# Altium schematic sheet Battery_PMIC_MCU_Prog_Schematic.SchDoc
size A; SheetNumber: 1; SheetTotal: 5
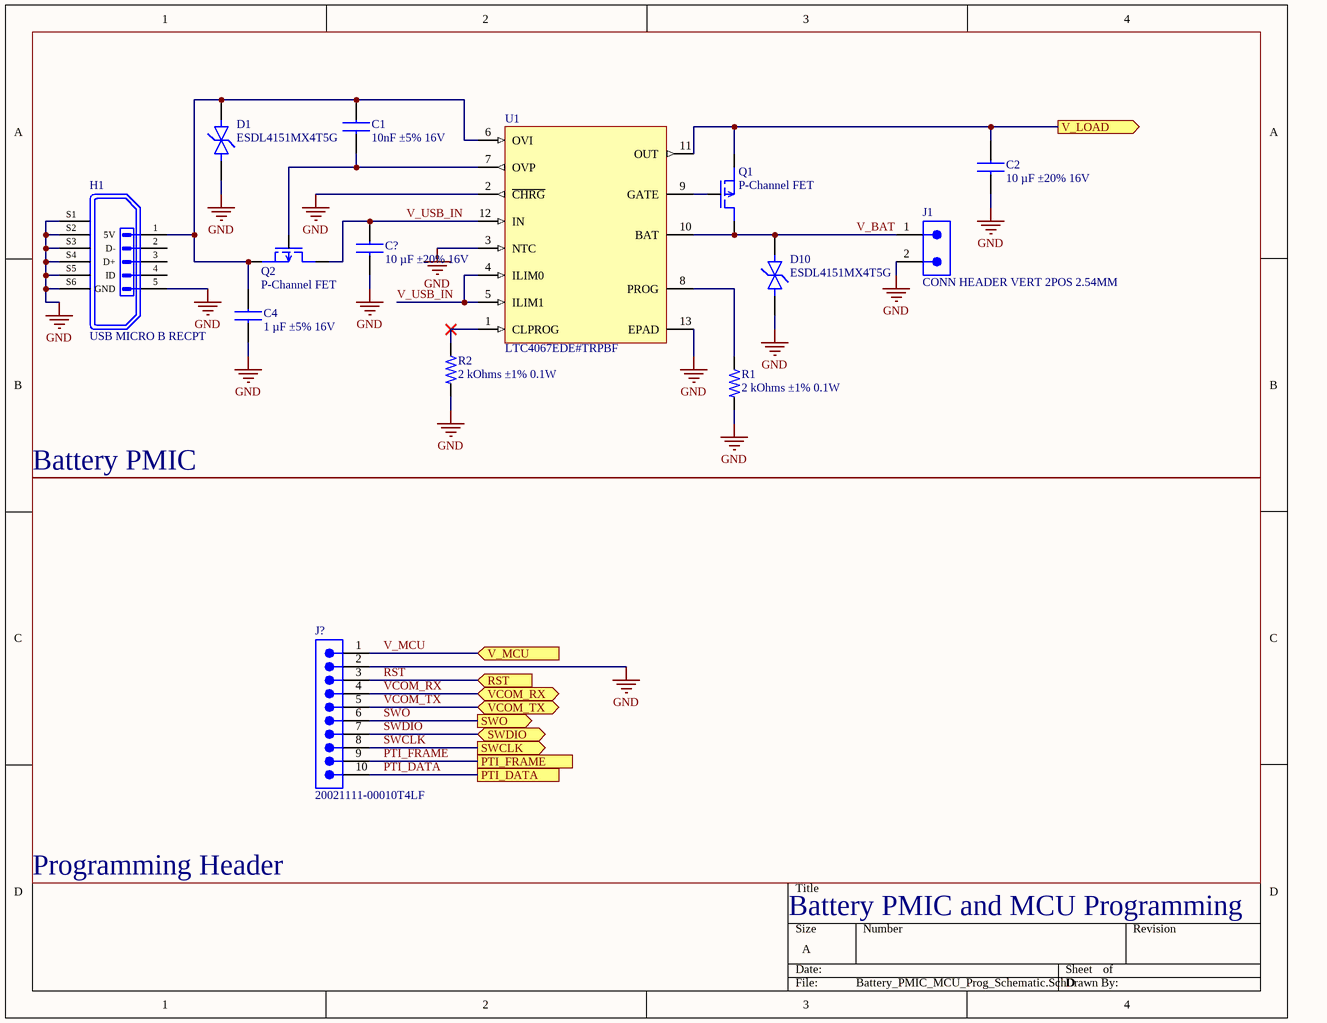
[diagram p0: Battery_PMIC_MCU_Prog_Schematic.SchDoc]

## Parts
C1  10nF ±5% 16V  [CAPC0603X09N]
C2  10 µF ±20% 16V  [CAPC0603X10N-M]
C4  1 µF ±5% 16V  [CAPC0603X10N]
C?  10 µF ±20% 16V  [CAPC0603X10N-M]
D1  ESDL4151MX4T5G  [DFN65P100X26-2N]
D10  ESDL4151MX4T5G  [DFN65P100X26-2N]
H1  USB MICRO B RECPT  [MICROUSB_AMPHENOL_10118194-0001LF]
J1  CONN HEADER VERT 2POS 2.54MM  [SAMTEC_TSW-102-14-L-S]
J?  20021111-00010T4LF  [CONN_MINITEK_2X5_HDR]
Q1  P-Channel FET  [SOT95P300X115-3N]
Q2  P-Channel FET  [SOT95P300X115-3N]
R1  2 kOhms ±1% 0.1W  [RESC0603X05N-1]
R2  2 kOhms ±1% 0.1W  [RESC0603X05N-1]
U1  LTC4067EDE#TRPBF  [SON50P300X80_HS-13N]

## Blocks framed on the sheet
Battery PMIC: C1 C2 C4 C? D1 D10 H1 J1 Q1 Q2 R1 R2 U1

## Ports
PTI_DATA, PTI_FRAME, RST (in), SWCLK (out), SWDIO (bidir), SWO (out), V_LOAD (out), V_MCU (in), VCOM_RX (bidir), VCOM_TX (bidir)

## Nets
GND: C2.2 C4.2 C?.2 D1.1 D10.1 H1.5(GND) H1.S1 H1.S2 H1.S3 H1.S4 H1.S5 H1.S6 J1.2 J?.2 R1.2 R2.2 U1.2(~{CHRG}) U1.3(NTC) U1.13(EPAD)
PTI_DATA: J?.10 ; port PTI_DATA
PTI_FRAME: J?.9 ; port PTI_FRAME
RST: J?.3 ; port RST
SWCLK: J?.8 ; port SWCLK
SWDIO: J?.7 ; port SWDIO
SWO: J?.6 ; port SWO
V_BAT: D10.2 J1.1 Q1.3 U1.10(BAT)
V_LOAD: C2.1 Q1.2 U1.11(OUT) ; port V_LOAD
V_MCU: J?.1 ; port V_MCU
V_USB_IN: C?.1 Q2.3 U1.4(ILIM0) U1.5(ILIM1) U1.12(IN)
VCOM_RX: J?.4 ; port VCOM_RX
VCOM_TX: J?.5 ; port VCOM_TX
NetC1_1: C1.1 C4.1 D1.2 H1.1(5V) Q2.2 U1.6(OVI)
NetC1_2: C1.2 Q2.1 U1.7(OVP)
NetQ1_1: Q1.1 U1.9(GATE)
NetR1_1: R1.1 U1.8(PROG)
NetR2_1: R2.1 U1.1(CLPROG)

Not connected (* = marked no-connect by the designer): H1 2(D-) 3(D+) 4(ID)

## Notes on the sheet
- Programming Header
- Battery PMIC and MCU Programming

## Library data of the parts
C1 = C0603C103J4RACTU: Cap Ceramic 0.01uF 16V X7R 5% SMD 0603 125°C Paper T/R; Manufacturer: KEMET; Dissipation Factor: 3.5%; Supplier 1: Digi-Key; Manufacturer Part Number: C0603C103J4RACTU; RoHS: Yes; Category: Ceramic Capacitors; Stock 1: 5301; Pricing 1: 1=0.35000, 10=0.24300, 50=0.16200, 100=0.13760, 500=0.09716, 1000=0.08501 (USD); Mount: Surface Mount; Case/Package: 0603; Case Code (Metric): 1608; Case Code (Imperial): 0603; Dielectric Material: Ceramic; Min Operating Temperature: -55°C; Max Operating Temperature: 125°C; Tolerance: 5%; Capacitance: 10nF; Dielectric: X7R; Packaging: Tape and Reel; Voltage Rating: 16V; Package Quantity: 1; Voltage Rating (DC): 16V; Termination: SMD/SMT; Series: C; Construction: Flat; Length: 1.6mm; Width: 0.031inch; Height: 0.8mm; Thickness: 0.034inch; Lead Pitch: 0.7mm; Depth: 0.8mm; Radiation Hardening: No; REACH SVHC: No SVHC; RoHS Compliant: Yes; ComponentLink1URL: https://datasheet.ciiva.com/5417/kem-c1002-x7r-smd-5417414.pdf?src-supplier=Mouser; ComponentLink1Description: https://datasheet.ciiva.com/5417/kem-c1002-x7r-smd-5417414.pdf?src-supplier=Mouser
C2 C? = GRT188C81C106ME13D: 0603 10 uF 16 V ±20% Tolerance X6S Surface Mount Multilayer Ceramic Capacitor; Manufacturer: Murata; Capacitance: 10uF; Supplier 1: Digi-Key; Manufacturer Part Number: GRT188C81C106ME13D; RoHS: No; Category: Ceramic Capacitors; Stock 1: 8428; Pricing 1: 1=0.50000, 10=0.34800, 50=0.24380, 100=0.20890, 500=0.15666, 1000=0.13230 (USD); Mount: Surface Mount; Case/Package: 0603; Case Code (Metric): 1608; Case Code (Imperial): 0603; Min Operating Temperature: -55°C; Max Operating Temperature: 105°C; Packaging: Tape and Reel; Voltage Rating: 16V; Tolerance: 20%; Length: 0.063inch; Width: 0.031inch; Thickness: 0.035inch; Ratings: AEC-Q200; RoHS Compliant: No; ComponentLink1URL: http://search.murata.co.jp/Ceramy/image/img/A01X/G101/ENG/GRT188C81C106ME13-01.pdf?src-supplier=Digi-Key; ComponentLink1Description: http://search.murata.co.jp/Ceramy/image/img/A01X/G101/ENG/GRT188C81C106ME13-01.pdf?src-supplier=Digi-Key
C4 = C0603X105J4RAC7867: Cap Ceramic 1uF 16V X7R 5% SMD 0603 125°C Paper T/R; Manufacturer: KEMET; Supplier 1: Digi-Key; Manufacturer Part Number: C0603X105J4RAC7867; RoHS: No; Category: Ceramic Capacitors; Stock 1: 20000; Pricing 1: 1=0.46000, 10=0.32200, 50=0.24340, 100=0.21210, 500=0.15708, 1000=0.13352 (USD); Mount: Surface Mount; Case/Package: 0603; Case Code (Imperial): 0603; Case Code (Metric): 1608; Min Operating Temperature: -55°C; Max Operating Temperature: 125°C; Features: Soft Termination; Packaging: Tape and Reel; Capacitance: 1uF; Tolerance: 5%; Voltage Rating: 16V; ComponentLink1URL: https://api.kemet.com/component-edge/download/datasheet/C0603X105J4RAC7867.pdf?src-supplier=Digi-Key; ComponentLink1Description: https://api.kemet.com/component-edge/download/datasheet/C0603X105J4RAC7867.pdf?src-supplier=Digi-Key
D1 D10 = ESDL4151MX4T5G: 15 V Bidirectional Low Capacitance ESD Protection Diode for High Speed Data Lines 15V; Manufacturer: ON Semiconductor; Supplier 1: Digi-Key; Manufacturer Part Number: ESDL4151MX4T5G; RoHS: Yes; Category: ESD and Circuit Protection ICs; Stock 1: 6875; Pricing 1: 1=0.49000, 10=0.36900, 100=0.23000, 500=0.15736, 1000=0.12105, 2000=0.10895 (USD); RoHS Compliant: Yes
H1 = 10118194-0001LF: USB - micro B USB 2.0 Receptacle Connector 5 Position Surface Mount, Right Angle; Through Hole; Manufacturer: Amphenol FCI; Number of Terminals/Pins: 5; Current Rating: 1.8A; Connector Type: USB,Receptacle; Insulation Resistance: 1GR; Number of Ports: 1; Max Voltage Rating (AC): 100V; Pitch: 0.65mm; Supplier 1: Digi-Key; Manufacturer Part Number: 10118194-0001LF; RoHS: Yes; Category: USB Connectors; Stock 1: 87961; Pricing 1: 1=0.48000, 10=0.45100, 25=0.38680, 50=0.32860, 100=0.31580, 250=0.28360, 500=0.27070 (USD); Mount: Surface Mount,Horizontal; Contact Material: Copper Alloy; Contact Plating: Gold; Housing Material: Polymer; Color: Black; Min Operating Temperature: -55°C; Max Operating Temperature: 85°C; Package Quantity: 9600; Packaging: Tape and Reel; Gender: Receptacle; Number of Contacts: 5; Termination: Solder; Orientation: Right Angle; Features: Shielded; Length: 8.05mm; Depth: 5mm; Radiation Hardening: No; Lead Free: Lead Free; Flammability Rating: UL94 V-0; ComponentLink1URL: https://datasheet.ciiva.com/4598/10118194ac-197217-4598807.pdf?src-supplier=Mouser; ComponentLink1Description: https://datasheet.ciiva.com/4598/10118194ac-197217-4598807.pdf?src-supplier=Mouser; ComponentLink2URL: https://datasheet.ciiva.com/26945/getdatasheetpartid-418619-26945695.pdf?src-supplier=Verical; ComponentLink2Description: https://datasheet.ciiva.com/26945/getdatasheetpartid-418619-26945695.pdf?src-supplier=Verical; ComponentLink3URL: https://datasheet.ciiva.com/851/10118194-851110.pdf?src-supplier=Digi-Key; ComponentLink3Description: https://datasheet.ciiva.com/851/10118194-851110.pdf?src-supplier=Digi-Key; ComponentLink4URL: https://datasheet.ciiva.com/851/10118194-851111.pdf?src-supplier=Digi-Key; ComponentLink4Description: https://datasheet.ciiva.com/851/10118194-851111.pdf?src-supplier=Digi-Key; Supplier Part Number 1: 609-4618-6-ND
J1 = TSW-102-14-L-S: SAMTEC - TSW-102-14-L-S - Board-To-Board Connector, Vertical, 2.54 mm, 2 Contacts, Header, TSW Series, Through Hole, 1 Rows; Number of Contacts: 2; Gender: Male; Max Current Rating: 7.6A; Max Voltage Rating (AC): 550V; Connector Type: Male Pin; Package: None; Price: None; Value: *; MP: TSW-102-14-L-S; Availability: Unavailable; Supplier 1: Digi-Key; Supplier 2: Digi-Key; Manufacturer: Samtec; Manufacturer Part Number: TSW-102-14-L-S; RoHS: Yes; Category: Connectors; Stock 2: 1225; Pricing 2: 1=0.25000, 10=0.23800, 25=0.20280, 50=0.17740, 100=0.16470, 250=0.14572, 500=0.13940 (USD); Mount: Through Hole; Contact Plating: Gold; Contact Material: Bronze; Color: Black; Housing Color: Black; Housing Material: Polyester; Min Operating Temperature: -55°C; Max Operating Temperature: 125°C; Number of Rows: 1; Termination: Solder; Packaging: Bulk; Number of Positions: 2; Orientation: Straight; Series: TSW; Contact Type: Male Pin; Package Quantity: 1; Current Rating: 7.6A; Voltage Rating: 550V; Length: 5.08mm; Width: 2.54mm; Pitch: 2.54mm; Depth: 2.54mm; Contact Mating Length: 0.32inch; Radiation Hardening: No; Lead Free: Lead Free; RoHS Compliant: Yes; REACH SVHC: No SVHC; ComponentLink1URL: https://datasheet.ciiva.com/25618/0900766b81154476-25618011.pdf?src-supplier=RSComponents; ComponentLink1Description: https://datasheet.ciiva.com/25618/0900766b81154476-25618011.pdf?src-supplier=RSComponents; ComponentLink2URL: https://datasheet.ciiva.com/6888/tsw-xxx-xx-xxx-x-xx-xxx-mkt-6888601.pdf?src-supplier=Digi-Key; ComponentLink2Description: https://datasheet.ciiva.com/6888/tsw-xxx-xx-xxx-x-xx-xxx-mkt-6888601.pdf?src-supplier=Digi-Key; ComponentLink3URL: https://datasheet.ciiva.com/16734/htsw-th-16734230.pdf?src-supplier=Avnet+Europe; ComponentLink3Description: https://datasheet.ciiva.com/16734/htsw-th-16734230.pdf?src-supplier=Avnet+Europe
J? = 20021111-00010T4LF: Conn Unshrouded Header HDR 10 POS 1.27mm Solder ST Top Entry Thru-Hole Minitek127® Tube; Mfr_Name: Amphenol ICC; Manufacturer: Amphenol ICC / FCI; Copyright: Copyright (C) 2022 Ultra Librarian. All rights reserved.; Manufacturer_Part_Number: 20021111-00010T4LF; Digi-Key_Part_Number_1: 609-3712-ND; RefDes: RefDes; Type: DEV; Supplier 1: Avnet; Manufacturer Part Number: 20021111-00010T4LF; RoHS: No; Category: Headers and Wire Housings; Stock 1: 3760; Pricing 1: 1=0.39546, 10=0.38532, 30=0.37518, 50=0.36504, 100=0.35490, 250=0.34476, 500=0.33462 (USD); ComponentLink1URL: http://components.arrow.com/part/dataview/0323_00898490?src-supplier=Arrow+Europe; ComponentLink1Description: http://components.arrow.com/part/dataview/0323_00898490?src-supplier=Arrow+Europe; ComponentLink2URL: http://uk.rs-online.com/webdocs/13f3/0900766b813f3563.pdf?src-supplier=RSComponents; ComponentLink2Description: http://uk.rs-online.com/webdocs/13f3/0900766b813f3563.pdf?src-supplier=RSComponents; ComponentLink3URL: http://www.farnell.com/datasheets/2374175.pdf?src-supplier=Farnell; ComponentLink3Description: http://www.farnell.com/datasheets/2374175.pdf?src-supplier=Farnell; ComponentLink4URL: http://portal.fciconnect.com/Comergent/fci/drawing/20021111.pdf?src-supplier=Avnet; ComponentLink4Description: http://portal.fciconnect.com/Comergent/fci/drawing/20021111.pdf?src-supplier=Avnet; ComponentLink5URL: https://cdn.amphenol-icc.com/media/wysiwyg/files/drawing/20021111.pdf?src-supplier=Digi-Key; ComponentLink5Description: https://cdn.amphenol-icc.com/media/wysiwyg/files/drawing/20021111.pdf?src-supplier=Digi-Key; ComponentLink6URL: http://portal.fciconnect.com/Comergent//fci/drawing/20021111.pdf?src-supplier=Mouser; ComponentLink6Description: http://portal.fciconnect.com/Comergent//fci/drawing/20021111.pdf?src-supplier=Mouser; ComponentLink7URL: http://www.farnell.com/datasheets/2374175.pdf?src-supplier=Newark; ComponentLink7Description: http://www.farnell.com/datasheets/2374175.pdf?src-supplier=Newark
Q1 Q2 = AO3419: Trans MOSFET P-CH 20V 3.5A 3-Pin SOT-23; Manufacturer: Alpha & Omega Semiconductor; Rds On Max: 85mR; Input Capacitance: 400pF; Max Power Dissipation: 1.4W; Number of Elements: 1; Supplier 1: Digi-Key; Manufacturer Part Number: AO3419; RoHS: Yes; Category: MOSFETs; Stock 1: 3227; Pricing 1: 1=0.43000, 10=0.32200, 100=0.20060, 500=0.13728, 1000=0.10560 (USD); Mount: Surface Mount; Case/Package: TO-236-3; Number of Pins: 3; Min Operating Temperature: -55°C; Max Operating Temperature: 150°C; Packaging: Tape and Reel; Drain to Source Voltage (Vdss): 20V; Continuous Drain Current (ID): 3.5A; Power Dissipation: 1.4W; Series: -; Radiation Hardening: No; Lead Free: Lead Free; RoHS Compliant: Yes; ComponentLink1URL: https://datasheet.ciiva.com/940/ao3419-940694.pdf?src-supplier=Digi-Key; ComponentLink1Description: https://datasheet.ciiva.com/940/ao3419-940694.pdf?src-supplier=Digi-Key; ComponentLink2URL: https://datasheet.ciiva.com/940/ao3419-940695.pdf?src-supplier=Digi-Key; ComponentLink2Description: https://datasheet.ciiva.com/940/ao3419-940695.pdf?src-supplier=Digi-Key; ComponentLink3URL: https://datasheet.ciiva.com/940/ao3419-940696.pdf?src-supplier=Digi-Key; ComponentLink3Description: https://datasheet.ciiva.com/940/ao3419-940696.pdf?src-supplier=Digi-Key
R1 R2 = CRCW06032K00FKTA: Res Thick Film 0603 2K Ohm 1% 1/10W ±100ppm/°C Molded SMD SMD Paper T/R; Manufacturer: Vishay Dale; Resistance: 2kR; Power Rating: 100mW; Voltage Rating: 75V; Supplier 1: Digi-Key; Manufacturer Part Number: CRCW06032K00FKTA; RoHS: No; Category: Chip SMD Resistors; Stock 1: 4209; Pricing 1: 1=0.16000, 10=0.13900, 100=0.05350, 1000=0.02353, 2500=0.02032 (USD); Mount: Surface Mount; Case/Package: 0603; Number of Pins: 2; Weight: 7.1E-05oz; Case Code (Imperial): 0603; Case Code (Metric): 1608; Contact Plating: Tin,Lead; Min Operating Temperature: -55°C; Max Operating Temperature: 155°C; Tolerance: 1%; Packaging: Tape and Reel; Package Quantity: 5000; Resistor Type: Thick Film; Number of Terminations: 2; Termination: SMD/SMT; Temperature Coefficient: 100ppm/°C; Max Power Dissipation: 100mW; Power Dissipation: 100mW; Voltage Rating (DC): 75V; Features: Automotive AEC-Q200; Series: CRCW; Construction: Rectangular; Resistance Tolerance: 1%; Length: 1.55mm; Width: 0.033inch; Height: 0.02inch; Depth: 0.85mm; Radiation Hardening: No; Lead Free: Contains Lead; RoHS Compliant: No; REACH SVHC: Unknown; Military Standard: Not; ComponentLink1URL: https://datasheet.ciiva.com/15159/getdatasheetpartid-28881-15159221.pdf?src-supplier=Verical; ComponentLink1Description: https://datasheet.ciiva.com/15159/getdatasheetpartid-28881-15159221.pdf?src-supplier=Verical; ComponentLink2URL: https://datasheet.ciiva.com/9093/dcrcw-9093590.pdf?src-supplier=Avnet; ComponentLink2Description: https://datasheet.ciiva.com/9093/dcrcw-9093590.pdf?src-supplier=Avnet; ComponentLink3URL: https://datasheet.ciiva.com/2565/dcrcw-2565199.pdf?src-supplier=Digi-Key; ComponentLink3Description: https://datasheet.ciiva.com/2565/dcrcw-2565199.pdf?src-supplier=Digi-Key; ComponentLink4URL: https://datasheet.ciiva.com/9094/dcrcw-9094813.pdf?src-supplier=Avnet; ComponentLink4Description: https://datasheet.ciiva.com/9094/dcrcw-9094813.pdf?src-supplier=Avnet
U1 = LTC4067EDE#TRPBF: IC USB POWER MANAGER 12-DFN; Manufacturer: Analog Devices / Linear Technology; Number of Outputs: 1; Supplier 1: Digi-Key; Manufacturer Part Number: LTC4067EDE#TRPBF; RoHS: Yes; Category: Battery Management; Stock 1: 1489; Pricing 1: 1=5.17000, 10=4.64200, 25=4.38840, 100=3.80330, 250=3.60824, 500=3.23766, 1000=3.03600 (USD); Case/Package: DFN; Number of Pins: 12; Min Operating Temperature: -40°C; Max Operating Temperature: 85°C; Package Quantity: 2500; Packaging: Tape and Reel; Number of Cells: 1; Series: -; Length: 4mm; RoHS Compliant: Yes; ComponentLink1URL: https://datasheet.ciiva.com/1933/25032-1933748.pdf?src-supplier=Digi-Key; ComponentLink1Description: https://datasheet.ciiva.com/1933/25032-1933748.pdf?src-supplier=Digi-Key